# Altium project WheatstoneBridge.PrjPcb
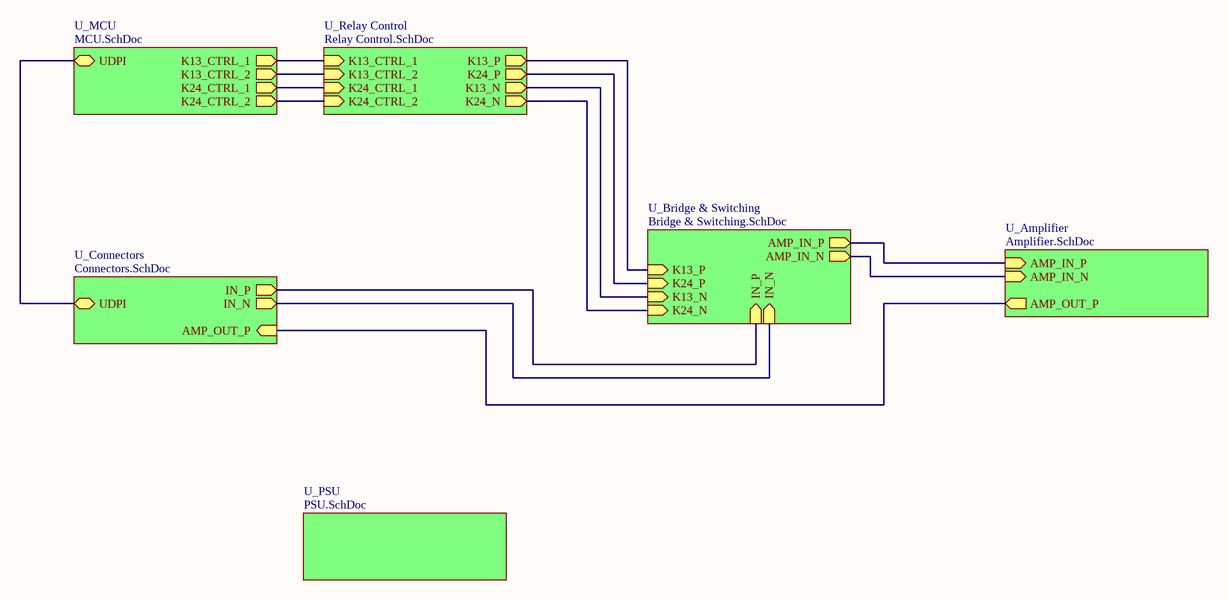
[diagram p0: TopSCH.SchDoc]
projTitle: Universal Wheatstone Bridge Amp; revision: V1.0
7 sheets, 66 parts. Net scope: hierarchical (ports join the sheet entries above them; power ports are global).
Board file: WheatstoneBridge.PcbDoc
Sheets:
  TopSCH.SchDoc
    U_Amplifier = Amplifier.SchDoc
    U_Bridge & Switching = Bridge & Switching.SchDoc
    U_PSU = PSU.SchDoc
    U_MCU = MCU.SchDoc
    U_Connectors = Connectors.SchDoc
    U_Relay Control = Relay Control.SchDoc

## Sheet TopSCH.SchDoc: FER_TEMPLATE
size A4; Author: Leon Baždar; CompanyName: FER; Address1: Zagreb; SheetNumber: 1; SheetTotal: 7

### Sub-sheets
U_Amplifier = Amplifier.SchDoc: AMP_IN_P (in), AMP_IN_N (in), AMP_OUT_P (out)
U_Bridge & Switching = Bridge & Switching.SchDoc: IN_P (in), IN_N (in), AMP_IN_P (out), AMP_IN_N (out), K13_P (in), K24_P (in), K13_N (in), K24_N (in)
U_Connectors = Connectors.SchDoc: IN_P (out), IN_N (out), AMP_OUT_P (in), UDPI (bidir)
U_MCU = MCU.SchDoc: K13_CTRL_1 (out), K13_CTRL_2 (out), K24_CTRL_1 (out), K24_CTRL_2 (out), UDPI (bidir)
U_PSU = PSU.SchDoc: no entries
U_Relay Control = Relay Control.SchDoc: K13_P (out), K24_P (out), K13_N (out), K24_N (out), K13_CTRL_1 (in), K13_CTRL_2 (in), K24_CTRL_1 (in), K24_CTRL_2 (in)

### Nets
AMP_IN_N: sheet U_Amplifier/AMP_IN_N, sheet U_Bridge & Switching/AMP_IN_N
AMP_IN_P: sheet U_Amplifier/AMP_IN_P, sheet U_Bridge & Switching/AMP_IN_P
IN_N: sheet U_Bridge & Switching/IN_N, sheet U_Connectors/IN_N
IN_P: sheet U_Bridge & Switching/IN_P, sheet U_Connectors/IN_P
K13_CTRL_1: sheet U_MCU/K13_CTRL_1, sheet U_Relay Control/K13_CTRL_1
K13_CTRL_2: sheet U_MCU/K13_CTRL_2, sheet U_Relay Control/K13_CTRL_2
K13_N: sheet U_Bridge & Switching/K13_N, sheet U_Relay Control/K13_N
K13_P: sheet U_Bridge & Switching/K13_P, sheet U_Relay Control/K13_P
K24_CTRL_1: sheet U_MCU/K24_CTRL_1, sheet U_Relay Control/K24_CTRL_1
K24_CTRL_2: sheet U_MCU/K24_CTRL_2, sheet U_Relay Control/K24_CTRL_2
K24_N: sheet U_Bridge & Switching/K24_N, sheet U_Relay Control/K24_N
K24_P: sheet U_Bridge & Switching/K24_P, sheet U_Relay Control/K24_P
OUT_P: sheet U_Amplifier/AMP_OUT_P, sheet U_Connectors/AMP_OUT_P
UDPI: sheet U_MCU/UDPI, sheet U_Connectors/UDPI

### Notes on the sheet
- Project:
- File:
- Size:
- A4
- Author:
- Revision:
- Date:
- Sheet
- of

## Sheet Amplifier.SchDoc: FER_TEMPLATE
size A4; Author: Leon Baždar; CompanyName: FER; Address1: Zagreb; SheetNumber: 2; SheetTotal: 7
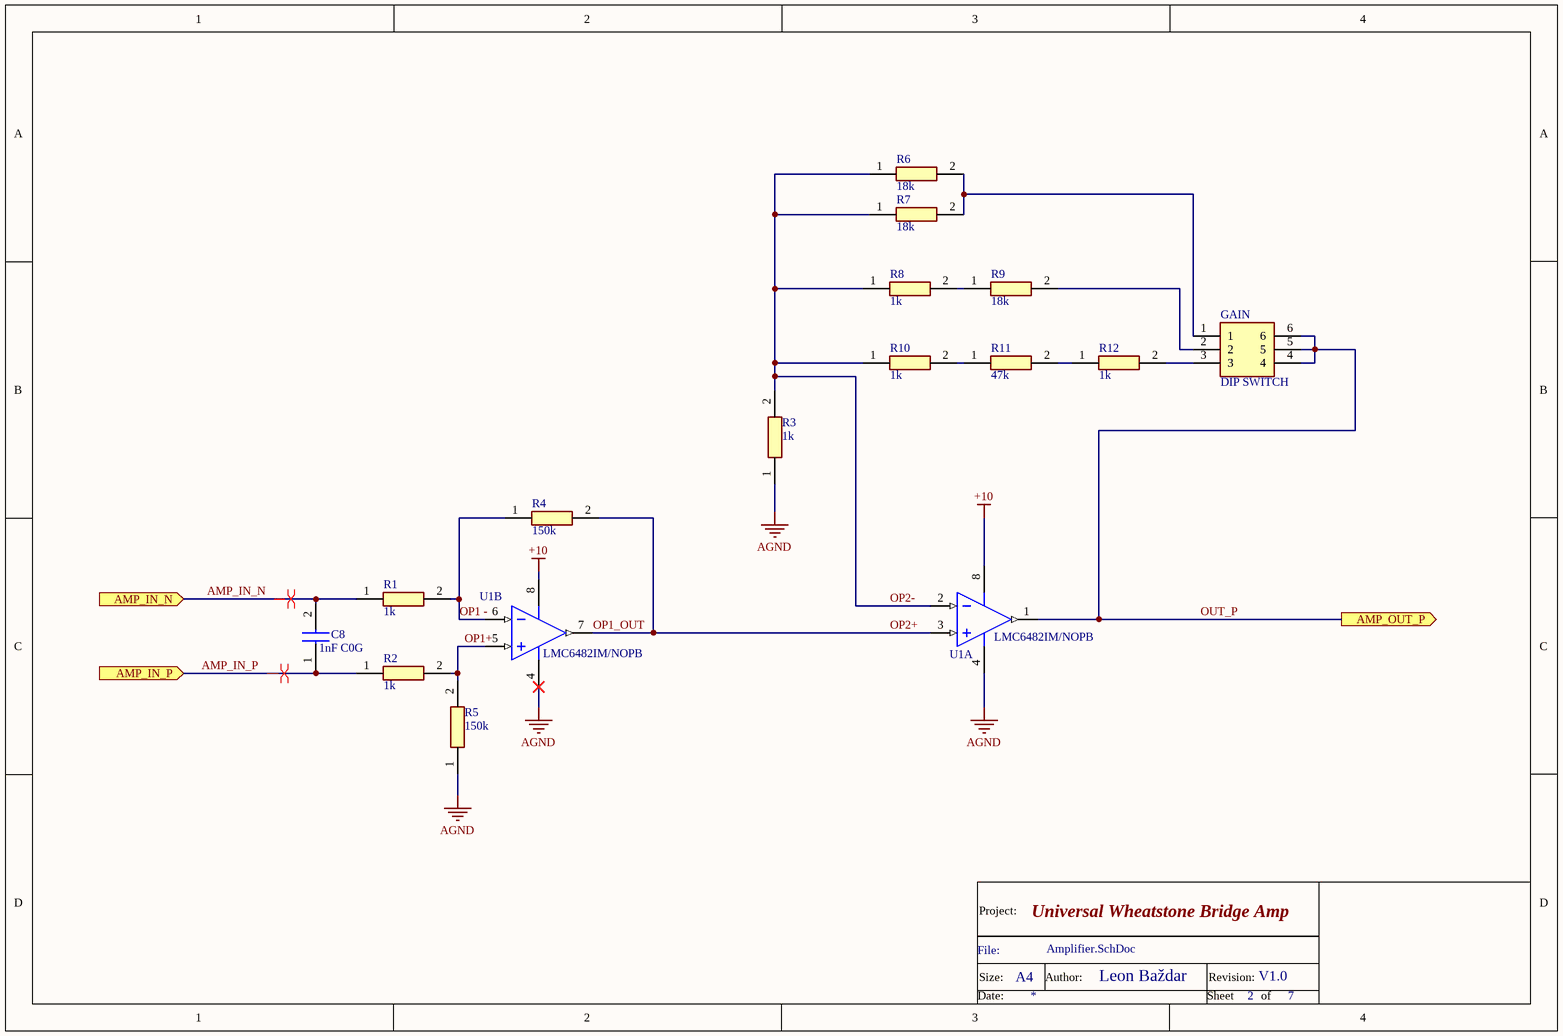
[diagram p1: Amplifier.SchDoc]

### Parts
C8  1nF C0G  [CAPC1005X55N]
GAIN  DIP SWITCH  [2193LPSTR]
R1  1k  [ERA2V_(0402)]
R2  1k  [ERA2V_(0402)]
R3  1k  [ERA2V_(0402)]
R4  150k  [RESC1005X35N]
R5  150k  [RESC1005X35N]
R6  18k  [RESC1005X35N]
R7  18k  [RESC1005X35N]
R8  1k  [ERA2V_(0402)]
R9  18k  [RESC1005X35N]
R10  1k  [ERA2V_(0402)]
R11  47k  [ERA2A_(0402)]
R12  1k  [ERA2V_(0402)]
U1  LMC6482IM/NOPB  [D0008A_N]  (parts A,B of 2)

### Ports
AMP_IN_N (in), AMP_IN_P (in), AMP_OUT_P (out)

### Nets
+10: U1.8(V+)  [project net WH_VCC]
AGND: R3.1 R5.1 U1.4(V-)
AMP_IN_N: C8.2 R1.1 ; port AMP_IN_N
AMP_IN_P: C8.1 R2.1 ; port AMP_IN_P
OP1 -: R1.2 R4.1 U1.6(INB-)
OP1+: R2.2 R5.2 U1.5(INB+)
OP1_OUT: R4.2 U1.3(INA+) U1.7(OUTB)  [also labelled OP2+]
OP2-: R3.2 R6.1 R7.1 R8.1 R10.1 U1.2(INA-)
OUT_P: GAIN.4 GAIN.5 GAIN.6 U1.1(OUTA) ; port AMP_OUT_P
NetGAIN_1: GAIN.1 R6.2 R7.2
NetGAIN_2: GAIN.2 R9.2
NetGAIN_3: GAIN.3 R12.2
NetR8_2: R8.2 R9.1
NetR10_2: R10.2 R11.1
NetR11_2: R11.2 R12.1

### Layout directives
differential pair: AMP_IN_N, AMP_IN_P

### Notes on the sheet
- Project:
- File:
- Size:
- A4
- Author:
- Revision:
- Date:
- Sheet
- of

### Library data of the parts
C8 = CGA2B2C0G1H102J050BE: Capacitor; Manufacturer_Name: TDK; Datasheet Link: https://product.tdk.com/system/files/dam/doc/product/capacitor/ceramic/mlcc/catalog/mlcc_automotive_soft_en.pdf; Height: 0.55mm; Manufacturer_Part_Number: CGA2B2C0G1H102J050BE
GAIN = 219-3LPSTR: Switch; Manufacturer_Name: CTS; Datasheet Link: https://www.ctscorp.com/wp-content/uploads/219.pdf; Height: 3.95mm; Manufacturer_Part_Number: 219-3LPSTR
R1-R3 R8 R10 R12 = ERA-2VEB1001X: Resistor; Manufacturer_Name: Panasonic; Datasheet Link: http://industrial.panasonic.com/cdbs/www-data/pdf/RDM0000/RDM0000C331.pdf; Height: 0.4mm; Manufacturer_Part_Number: ERA-2VEB1001X
R4 R5 = CPF0402B150KE1: Resistor; Manufacturer_Name: TE Connectivity; Height: 0.35mm; Manufacturer_Part_Number: CPF0402B150KE1
R6 R7 R9 = CPF0402B18KE1: Resistor; Manufacturer_Name: TE Connectivity; Height: 0.35mm; Manufacturer_Part_Number: CPF0402B18KE1
R11 = ERA-2APB473X: Resistor; Manufacturer_Name: Panasonic; Datasheet Link: http://industrial.panasonic.com/cdbs/www-data/pdf/RDM0000/AOA0000C307.pdf; Height: 0.4mm; Manufacturer_Part_Number: ERA-2APB473X
U1 = CMP-0055-00847-3: CMOS Dual Rail-to-Rail Input and Output Operational Amplifier, 8-pin Narrow SOIC, Pb-Free; Manufacturer: Texas Instruments; PackageTopMarking: NSZXTT*LMC64*82IM; CompType: Amplifiers; PowerWise: N; ComponentLink1URL: http://www.ti.com/general/docs/lit/getliterature.tsp?genericPartNumber=LMC6482&fileType=pdf; Code_IPC: SOIC127P600-8; RoHS: Y; PinCount: 8; PackageDescription: SOIC Narrow, 4.9 x 3.9 x 1.45mm, 8 Lead, 1.27mm Pitch; Package Reference: D0008A; ComponentLink1Description: Datasheet URL; Code_JEDEC: MS-012-AA

## Sheet Bridge & Switching.SchDoc: FER_TEMPLATE
size A4; Author: Leon Baždar; CompanyName: FER; Address1: Zagreb; SheetNumber: 5; SheetTotal: 7
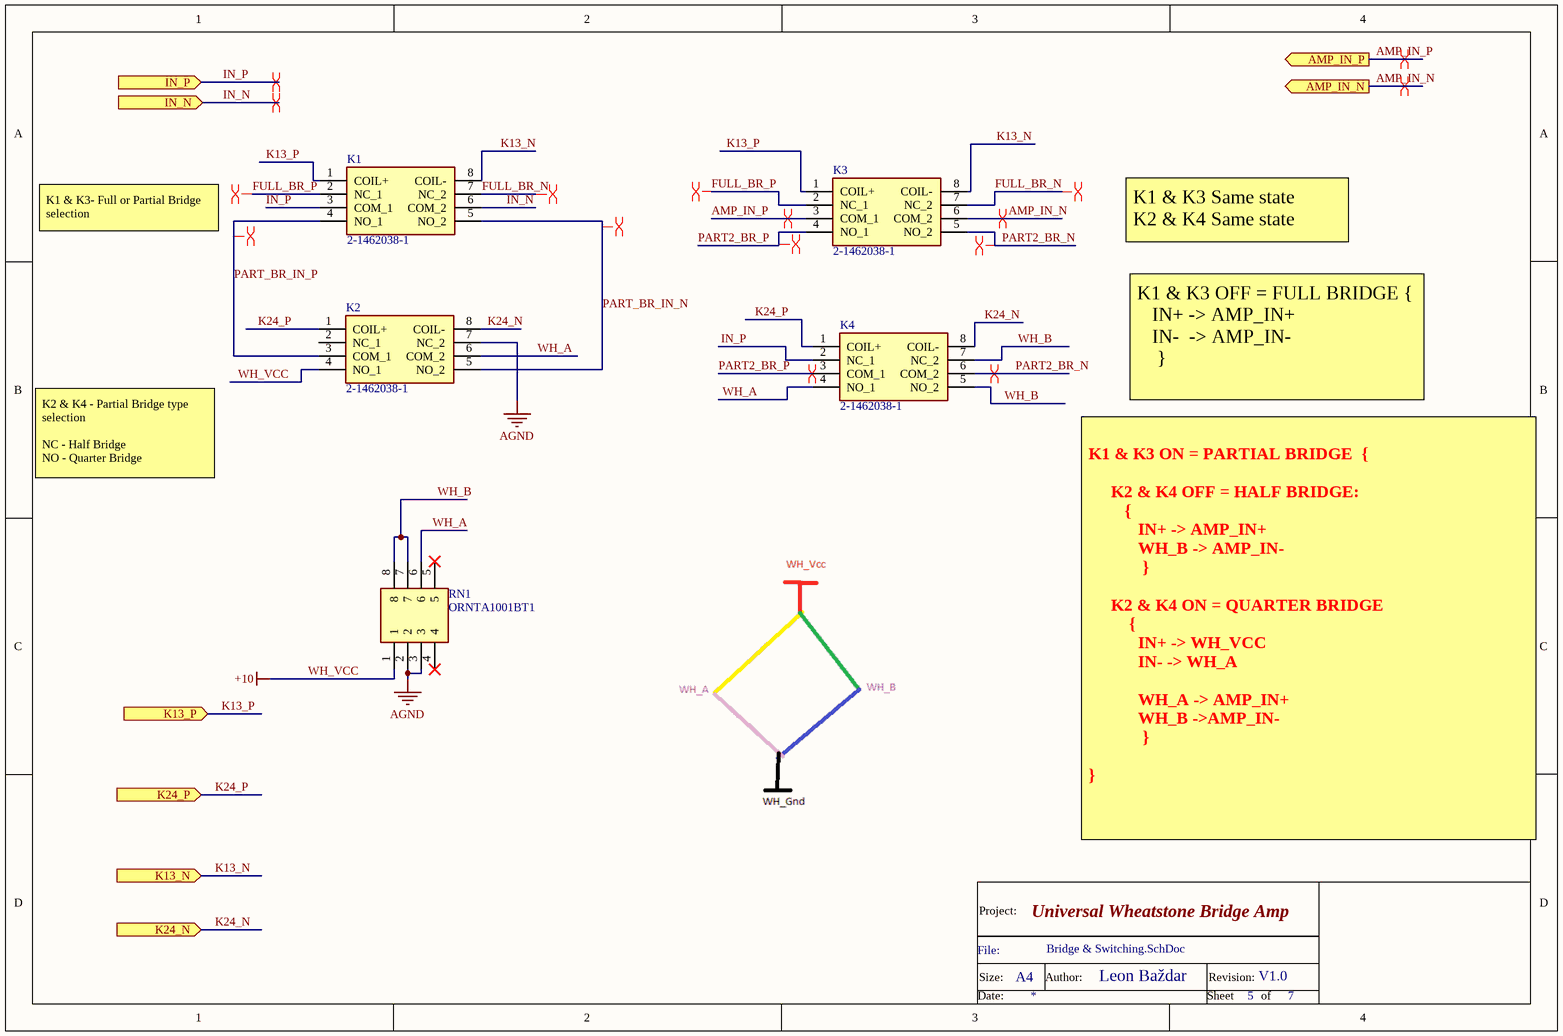
[diagram p2: Bridge & Switching.SchDoc]

### Parts
K1  2-1462038-1  [214620381]
K2  2-1462038-1  [214620381]
K3  2-1462038-1  [214620381]
K4  2-1462038-1  [214620381]
RN1  ORNTA1001BT1  [SOIC127P607X173-8N]

### Ports
AMP_IN_N (out), AMP_IN_P (out), IN_N (in), IN_P (in), K13_N (in), K13_P (in), K24_N (in), K24_P (in)

### Nets
AGND: K2.7(NC_2) RN1.2 RN1.3
WH_VCC: K2.4(NO_1) RN1.1  [also labelled +10]
AMP_IN_N: K3.6(COM_2) ; port AMP_IN_N
AMP_IN_P: K3.3(COM_1) ; port AMP_IN_P
FULL_BR_N: K1.7(NC_2) K3.7(NC_2)
FULL_BR_P: K1.2(NC_1) K3.2(NC_1)
IN_N: K1.6(COM_2) ; port IN_N
IN_P: K1.3(COM_1) K4.2(NC_1) ; port IN_P
K13_N: K1.8(COIL-) K3.8(COIL-) ; port K13_N
K13_P: K1.1(COIL+) K3.1(COIL+) ; port K13_P
K24_N: K2.8(COIL-) K4.8(COIL-) ; port K24_N
K24_P: K2.1(COIL+) K4.1(COIL+) ; port K24_P
PART2_BR_N: K3.5(NO_2) K4.6(COM_2)
PART2_BR_P: K3.4(NO_1) K4.3(COM_1)
PART_BR_IN_N: K1.5(NO_2) K2.5(NO_2)
PART_BR_IN_P: K1.4(NO_1) K2.3(COM_1)
WH_A: K2.6(COM_2) K4.4(NO_1) RN1.6
WH_B: K4.5(NO_2) K4.7(NC_2) RN1.7 RN1.8

Not connected (* = marked no-connect by the designer): K2 2(NC_1); RN1 4* 5*

### Layout directives
differential pair: AMP_IN_N, AMP_IN_P, FULL_BR_N, FULL_BR_P, IN_N, IN_P, PART2_BR_N, PART2_BR_P, PART_BR_IN_N, PART_BR_IN_P

### Notes on the sheet
- K1 & K3- Full or Partial Bridge selection
- K1 & K3 Same state
  K2 & K4 Same state
- K1 & K3 OFF = FULL BRIDGE {
  IN+ -> AMP_IN+
  IN-  -> AMP_IN-
  }
- K2 & K4 - Partial Bridge type selection
  NC - Half Bridge
  NO - Quarter Bridge
- K1 & K3 ON = PARTIAL BRIDGE  {
  K2 & K4 OFF = HALF BRIDGE:
  {
  IN+ -> AMP_IN+
  WH_B -> AMP_IN-
  }
  K2 & K4 ON = QUARTER BRIDGE
  {
  IN+ -> WH_VCC
  IN- -> WH_A
  WH_A -> AMP_IN+
  WH_B ->AMP_IN-
  }
  }
- Project:
- File:
- Size:
- A4
- Author:
- Revision:
- Date:
- Sheet
- of

### Library data of the parts
K1-K4 = 2-1462038-1: Relay or Contactor; Manufacturer_Name: TE Connectivity; Datasheet Link: https://www.te.com/commerce/DocumentDelivery/DDEController?Action=srchrtrv&DocNm=108-98001&DocType=Data+Sheet&DocLang=English&PartCntxt=2-1462038-1&DocFormat=pdf; Height: 5.8mm; Manufacturer_Part_Number: 2-1462038-1
RN1 = ORNTA1001BT1: Resistor Network; Manufacturer_Name: Vishay; Datasheet Link: https://www.vishay.com/docs/60005/orn.pdf; Height: 1.73mm; Manufacturer_Part_Number: ORNTA1001BT1; Mouser Part Number: 71-ORNTA1001BT1; Mouser Price/Stock: https://www.mouser.co.uk/ProductDetail/Vishay-Thin-Film/ORNTA1001BT1?qs=EiQZnNXpF8A9ZYJTqcYggA%3D%3D

## Sheet PSU.SchDoc
size A4; SheetNumber: 3; SheetTotal: 7
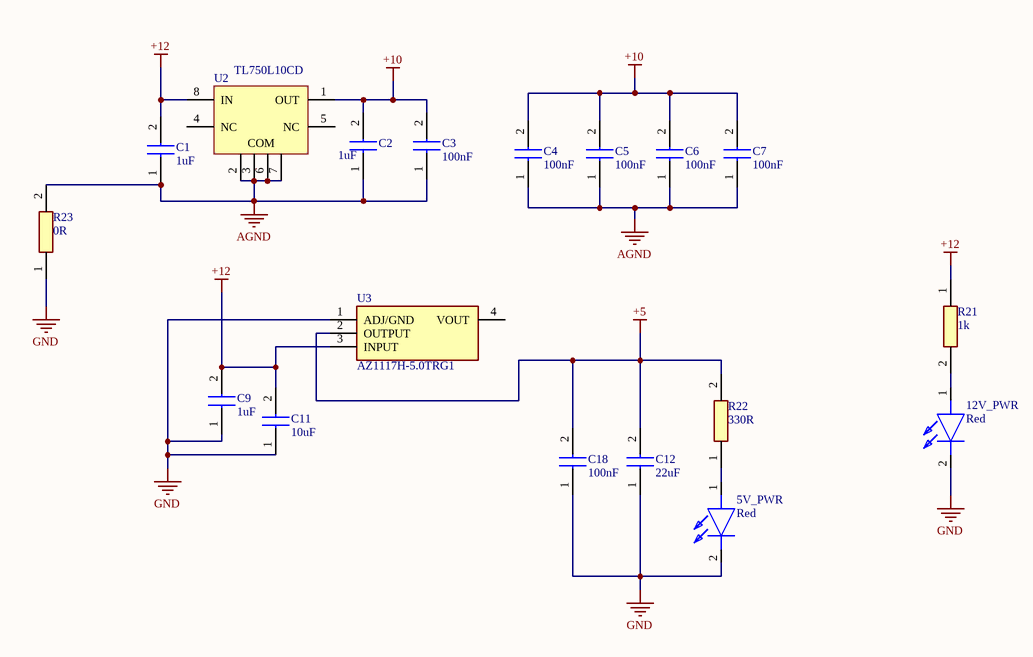
[diagram p3: PSU.SchDoc]

### Parts
5V_PWR  Red  [APT2012SECKJ3PRV]
12V_PWR  Red  [APT2012SECKJ3PRV]
C1  1uF  [CAPC1005X55N]
C2  1uF  [CAPC1005X55N]
C3  100nF  [CAPC1005X55N]
C4  100nF  [CAPC1005X55N]
C5  100nF  [CAPC1005X55N]
C6  100nF  [CAPC1005X55N]
C7  100nF  [CAPC1005X55N]
C9  1uF  [CAPC1005X55N]
C11  10uF  [C1608_Commercial]
C12  22uF  [C3216_Commercial]
C18  100nF  [CAPC1005X55N]
R21  1k  [ERA2V_(0402)]
R22  330R  [ERJ2RKD1004X]
R23  0R  [RESC1005X40N]
U2  TL750L10CD  [D0008A_M]
U3  AZ1117H-5.0TRG1  [SOT230P700X180-4N]

### Nets
+5: C12.2 C18.2 R22.2 U3.2(OUTPUT)
+10: C2.2 C3.2 C4.2 C5.2 C6.2 C7.2 U2.1(OUT)  [project net WH_VCC]
+12: C1.2 C9.2 C11.2 R21.1 U2.8(IN) U3.3(INPUT)
AGND: C1.1 C2.1 C3.1 C4.1 C5.1 C6.1 C7.1 R23.2 U2.2(COM) U2.3(COM) U2.6(COM) U2.7(COM)
GND: 5V_PWR.2(K) 12V_PWR.2(K) C9.1 C11.1 C12.1 C18.1 R23.1 U3.1(ADJ/GND)
Net5V_PWR_1: 5V_PWR.1(A) R22.1
Net12V_PWR_1: 12V_PWR.1(A) R21.2

Not connected (* = marked no-connect by the designer): U2 4(NC) 5(NC); U3 4(VOUT)

### Notes on the sheet
- Project:
- File:
- Size:
- A4
- Author:
- Revision:
- Date:
- Sheet
- of

### Library data of the parts
5V_PWR 12V_PWR = APT2012SECK_J3-PRV: LED; Manufacturer_Name: Kingbright; Manufacturer_Part_Number: APT2012SECK/J3-PRV; Datasheet Link: https://www.mouser.de/datasheet/2/216/APT2012SECK-J3-PRV-1173389.pdf; Height: 0.85mm
C1 C2 C9 = GRT155C81E105KE13D: Capacitor; Manufacturer_Name: Murata Electronics; Datasheet Link: https://psearch.en.murata.com/capacitor/product/GRT155C81E105KE13%23.html; Height: 0.55mm; Manufacturer_Part_Number: GRT155C81E105KE13D
C3-C7 C18 = GCM155L81E104KE02D: Capacitor; Manufacturer_Name: Murata Electronics; Datasheet Link: https://psearch.en.murata.com/capacitor/product/GCM155L81E104KE02%23.html; Height: 0.55mm; Manufacturer_Part_Number: GCM155L81E104KE02D
C11 = C1608JB1E106M080AC: Capacitor; Manufacturer_Name: TDK; Datasheet Link: https://product.tdk.com/system/files/dam/doc/product/capacitor/ceramic/mlcc/catalog/mlcc_commercial_general_en.pdf; Height: 0.9mm; Manufacturer_Part_Number: C1608JB1E106M080AC
C12 = C3216X6S1E226M160AC: Capacitor; Manufacturer_Name: TDK; Datasheet Link: https://product.tdk.com/system/files/dam/doc/product/capacitor/ceramic/mlcc/catalog/mlcc_commercial_general_en.pdf; Height: 0.75mm; Manufacturer_Part_Number: C3216X6S1E226M160AC
R21 = ERA-2VEB1001X: Resistor; Manufacturer_Name: Panasonic; Datasheet Link: http://industrial.panasonic.com/cdbs/www-data/pdf/RDM0000/RDM0000C331.pdf; Height: 0.4mm; Manufacturer_Part_Number: ERA-2VEB1001X
R22 = ERJ-2RHD3300X: Resistor; Manufacturer_Name: Panasonic; Datasheet Link: https://datasheet.datasheetarchive.com/originals/distributors/DKDS41/DSANUWW0038499.pdf; Height: 0.4mm; Manufacturer_Part_Number: ERJ-2RHD3300X
R23 = RC0402JR-130RL: Resistor; Manufacturer_Name: YAGEO (PHYCOMP); Datasheet Link: https://datasheet.datasheetarchive.com/originals/distributors/Datasheets_SAMA/902f9e387b938f871d31120f5fc1d65e.pdf; Height: 0.4mm; Manufacturer_Part_Number: RC0402JR-130RL
U2 = CMP-0394-00106-2: Single Output LDO, 150 mA, Fixed 10 V Output, 11 to 26 V Input, with Low IQ, 8-pin SOIC (D), 0 to 125 degC, Green (RoHS & no Sb/Br); Manufacturer: Texas Instruments; Fixed Output Options(V): 10; Accuracy(%): 4; Vdo(Typ)(mV): 600; Rating: Catalog; Iq(Typ)(mA): 1; SubFamily: Single Channel LDO; Iout(Max)(A): 0.15; Vin(Min)(V): 11; Vin(Max)(V): 26; ComponentLink1URL: http://www.ti.com/; ComponentLink3URL: http://www.ti.com/litv/pdf/msoi002j; ComponentLink4Description: URL Link1; Eco-Plan: Green (RoHS & no Sb/Br); PackageVersion: 4040047-3/M; Vout Adj(Min)(V): 10; Mounting Technology: Surface Mount; ComponentLink1Description: Manufacturer URL; PartNumber: TL750L10CD; PackageDescription: 8-Pin Plastic Small Outline, Body 4.9 x 3.9 mm, Pitch 1.27 mm; Code_JEDEC: MS-012; ComponentLink2URL: http://www.ti.com/general/docs/lit/getliterature.tsp?genericPartNumber=TL750L10&fileType=pdf; Vout Adj(Max)(V): 10; ComponentLink2Description: Datasheet; ComponentLink3Description: Package Specification; ComponentLink4URL: Samples URL:http://www.ti.com/product/tl750l10#samples; DatasheetVersion: SLVS017U; PackageReference: D0008A
U3 = AZ1117H-5.0TRG1: Integrated Circuit; Manufacturer_Name: Diodes Inc.; Datasheet Link: https://media.digikey.com/pdf/Data%20Sheets/Diodes%20PDFs/AZ1117_Rev2.1.pdf; Height: 1.8mm; Manufacturer_Part_Number: AZ1117H-5.0TRG1

## Sheet MCU.SchDoc: FER_TEMPLATE
size A4; Author: Leon Baždar; CompanyName: FER; Address1: Zagreb; SheetNumber: 7; SheetTotal: 7
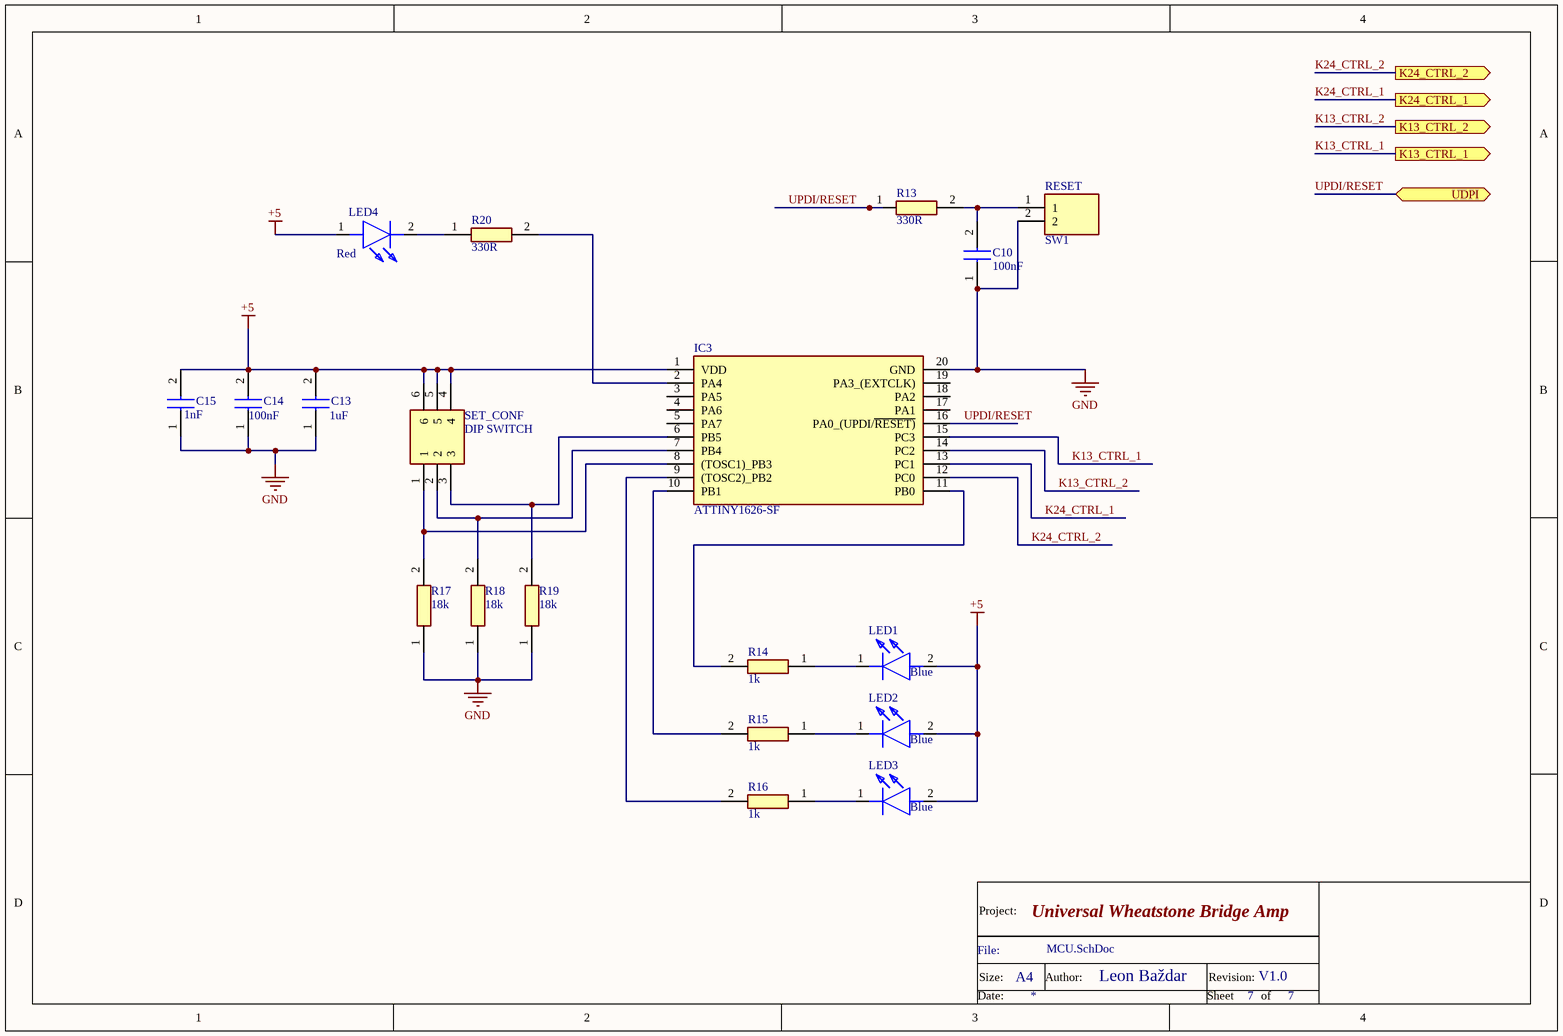
[diagram p4: MCU.SchDoc]

### Parts
C10  100nF  [CAPC1005X55N]
C13  1uF  [CAPC1005X55N]
C14  100nF  [CAPC1005X55N]
C15  1nF  [CAPC1005X55N]
IC3  ATTINY1626-SF  [SOIC127P1030X265-20N]
LED1  Blue  [LEDC2012X85N]
LED2  Blue  [LEDC2012X85N]
LED3  Blue  [LEDC2012X85N]
LED4  Red  [APT2012SECKJ3PRV]
R13  330R  [ERJ2RKD1004X]
R14  1k  [ERA2V_(0402)]
R15  1k  [ERA2V_(0402)]
R16  1k  [ERA2V_(0402)]
R17  18k  [RESC1005X35N]
R18  18k  [RESC1005X35N]
R19  18k  [RESC1005X35N]
R20  330R  [ERJ2RKD1004X]
RESET  SW1  [95C04A3GWRT]
SET_CONF  DIP SWITCH  [2193LPSTR]

### Ports
K13_CTRL_1 (out), K13_CTRL_2 (out), K24_CTRL_1 (out), K24_CTRL_2 (out), UDPI (bidir)

### Nets
+5: C13.2 C14.2 C15.2 IC3.1(VDD) LED1.2(A) LED2.2(A) LED3.2(A) LED4.1(A) SET_CONF.4 SET_CONF.5 SET_CONF.6
GND: C10.1 C13.1 C14.1 C15.1 IC3.20(GND) R17.1 R18.1 R19.1 RESET.2
K13_CTRL_1: IC3.15(PC3) ; port K13_CTRL_1
K13_CTRL_2: IC3.14(PC2) ; port K13_CTRL_2
K24_CTRL_1: IC3.13(PC1) ; port K24_CTRL_1
K24_CTRL_2: IC3.12(PC0) ; port K24_CTRL_2
UPDI/RESET: IC3.16(PA0_(UPDI/~{RESET)}) R13.1 ; port UDPI  [project net UDPI]
NetC10_2: C10.2 R13.2 RESET.1
NetIC3_2: IC3.2(PA4) R20.2
NetIC3_6: IC3.6(PB5) R19.2 SET_CONF.3
NetIC3_7: IC3.7(PB4) R18.2 SET_CONF.2
NetIC3_8: IC3.8((TOSC1)_PB3) R17.2 SET_CONF.1
NetIC3_9: IC3.9((TOSC2)_PB2) R16.2
NetIC3_10: IC3.10(PB1) R15.2
NetIC3_11: IC3.11(PB0) R14.2
NetLED1_1: LED1.1(K) R14.1
NetLED2_1: LED2.1(K) R15.1
NetLED3_1: LED3.1(K) R16.1
NetLED4_2: LED4.2(K) R20.1

Not connected (* = marked no-connect by the designer): IC3 3(PA5) 4(PA6) 5(PA7) 17(PA1) 18(PA2) 19(PA3_(EXTCLK))

### Notes on the sheet
- Project:
- File:
- Size:
- A4
- Author:
- Revision:
- Date:
- Sheet
- of

### Library data of the parts
C10 C14 = GCM155L81E104KE02D: as C3 on sheet PSU; Datasheet Link: https://psearch.en.murata.com/capacitor/product/GCM155L81E104KE02%23.html; Height: 0.55mm; Manufacturer_Part_Number: GCM155L81E104KE02D
C13 = GRT155C81E105KE13D: as C1 on sheet PSU; Datasheet Link: https://psearch.en.murata.com/capacitor/product/GRT155C81E105KE13%23.html; Height: 0.55mm; Manufacturer_Part_Number: GRT155C81E105KE13D
C15 = CGA2B2C0G1H102J050BE: Capacitor; Manufacturer_Name: TDK; Datasheet Link: https://product.tdk.com/system/files/dam/doc/product/capacitor/ceramic/mlcc/catalog/mlcc_automotive_soft_en.pdf; Height: 0.55mm; Manufacturer_Part_Number: CGA2B2C0G1H102J050BE
IC3 = ATTINY1626-SF: Integrated Circuit; Manufacturer_Name: Microchip; Datasheet Link: https://ww1.microchip.com/downloads/aemDocuments/documents/MCU08/ProductDocuments/DataSheets/ATtiny1624-26-27-DataSheet-DS40002234B.pdf; Height: 2.65mm; Manufacturer_Part_Number: ATTINY1626-SF
LED1-LED3 = APT2012LVBC_D: LED; Manufacturer_Name: Kingbright; Manufacturer_Part_Number: APT2012LVBC/D; Datasheet Link: https://componentsearchengine.com//APT2012LVBC_D.pdf; Height: 0.85mm; Mouser2 Part Number: 604-APT2012LVBCD; Mouser2 Price/Stock: https://www.mouser.com/Search/Refine.aspx?Keyword=604-APT2012LVBCD
LED4 = APT2012SECK_J3-PRV: as 5V_PWR on sheet PSU; Datasheet Link: https://www.mouser.de/datasheet/2/216/APT2012SECK-J3-PRV-1173389.pdf; Height: 0.85mm
R13 R20 = ERJ-2RHD3300X: Resistor; Manufacturer_Name: Panasonic; Datasheet Link: https://datasheet.datasheetarchive.com/originals/distributors/DKDS41/DSANUWW0038499.pdf; Height: 0.4mm; Manufacturer_Part_Number: ERJ-2RHD3300X
R14-R16 = ERA-2VEB1001X: Resistor; Manufacturer_Name: Panasonic; Datasheet Link: http://industrial.panasonic.com/cdbs/www-data/pdf/RDM0000/RDM0000C331.pdf; Height: 0.4mm; Manufacturer_Part_Number: ERA-2VEB1001X
R17-R19 = CPF0402B18KE1: as R6 on sheet Amplifier; Height: 0.35mm; Manufacturer_Part_Number: CPF0402B18KE1
RESET = 95C04A3GWRT: Switch; Manufacturer_Name: Grayhill; Datasheet Link: https://componentsearchengine.com//95C04A3GWRT.pdf; Mouser2 Part Number: 706-95C04A3GWRT; Mouser2 Price/Stock: https://www.mouser.com/Search/Refine.aspx?Keyword=706-95C04A3GWRT; Manufacturer_Part_Number: 95C04A3GWRT
SET_CONF = 219-3LPSTR: Switch; Manufacturer_Name: CTS; Datasheet Link: https://www.ctscorp.com/wp-content/uploads/219.pdf; Height: 3.95mm; Manufacturer_Part_Number: 219-3LPSTR

## Sheet Connectors.SchDoc: FER_TEMPLATE
size A4; Author: Leon Baždar; CompanyName: FER; Address1: Zagreb; SheetNumber: 4; SheetTotal: 7
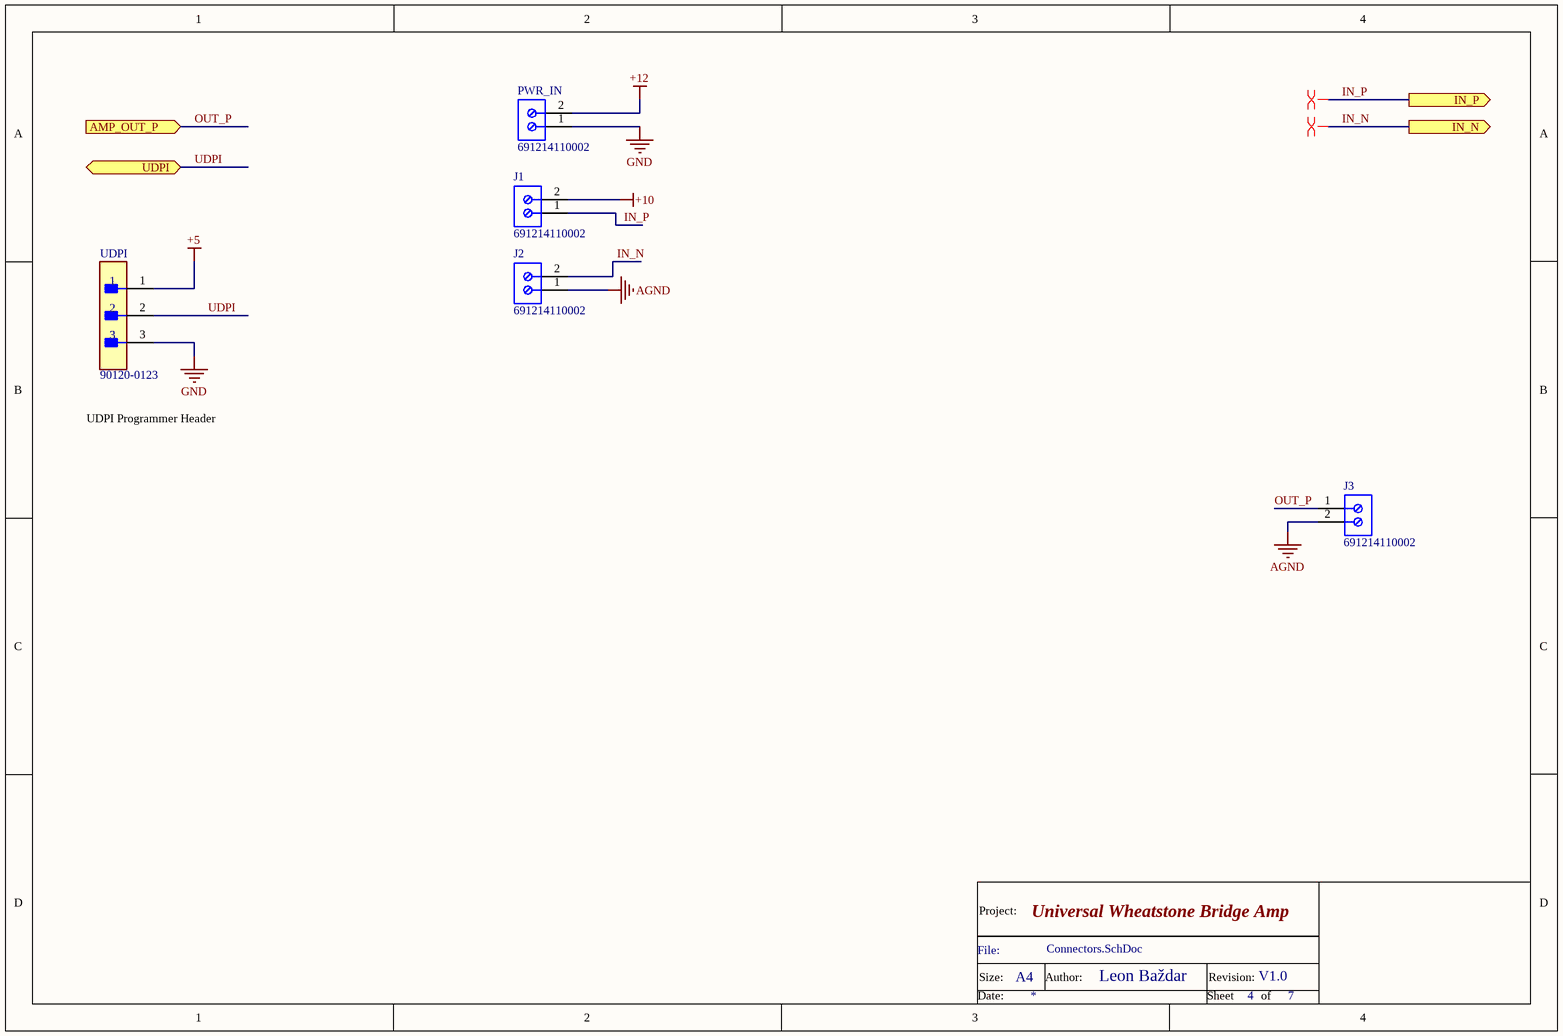
[diagram p5: Connectors.SchDoc]

### Parts
J1  691214110002  [691214110002]
J2  691214110002  [691214110002]
J3  691214110002  [691214110002]
PWR_IN  691214110002  [691214110002]
UDPI  90120-0123  [FP-90120-0123-MFG]

### Ports
AMP_OUT_P (in), IN_N (out), IN_P (out), UDPI (bidir)

### Nets
+5: UDPI.1
+10: J1.2  [project net WH_VCC]
+12: PWR_IN.2
AGND: J2.1 J3.2
GND: PWR_IN.1 UDPI.3
IN_N: J2.2 ; port IN_N
IN_P: J1.1 ; port IN_P
OUT_P: J3.1 ; port AMP_OUT_P
UDPI: UDPI.2 ; port UDPI

### Layout directives
differential pair: IN_N, IN_P

### Notes on the sheet
- UDPI Programmer Header
- Project:
- File:
- Size:
- A4
- Author:
- Revision:
- Date:
- Sheet
- of

### Library data of the parts
J1-J3 PWR_IN = CMP-1502-02464-1: Serie 2141 - 3.50 mm Horizontal Entry Modular with Rising Cage Clamp WR-TBL, 2 pin; Manufacturer: Wurth Elektronik; Pin Number: 2; Pitch: 3.50mm; Datasheet URL: http://katalog.we-online.de/em/datasheet/6912141100xx.pdf; Packaging: Box; Mounting Technology: THT; Package Reference: 691214110002; Manufacturer URL: http://www.we-online.de; Part Number: 691214110002; Publisher: WurthElektronik; Operating Temperature: -40to105degC
UDPI = CMP-04776-000237-1: CONN HEADER VERT 3POS 2.54MM; Number of Circuits: 3; Max Voltage Rating (DC): 350.35kV; Contact Resistance: 20mR; Gender: Male; Voltage Rating (AC): 350V; Glow Wire Compliant: Non-compliant; Current Rating: 3A; Contact Post Length: 2.9mm; Number of Contacts: 3; Number of Rows: 1; Max Operating Temperature: 125°C; Orientation: Vertical; Number of Positions: 3; Packaging: Tray; Contact Mating Length: 6.75mm; Housing Color: Black; Termination: Solder; Contact Material: Brass; Radiation Hardening: No; Lead Free: Lead Free; Pitch: 2.54mm; RoHS Compliant: Yes; Voltage Rating: 350V; Contact Plating: Tin; Color: Black; Min Operating Temperature: -55°C; Mount: Through Hole; Housing Material: Polyester; Series: 90120; Contact Gender: Male; REACH SVHC: No SVHC

## Sheet Relay Control.SchDoc: FER_TEMPLATE
size A4; Author: Leon Baždar; CompanyName: FER; Address1: Zagreb; SheetNumber: 6; SheetTotal: 7
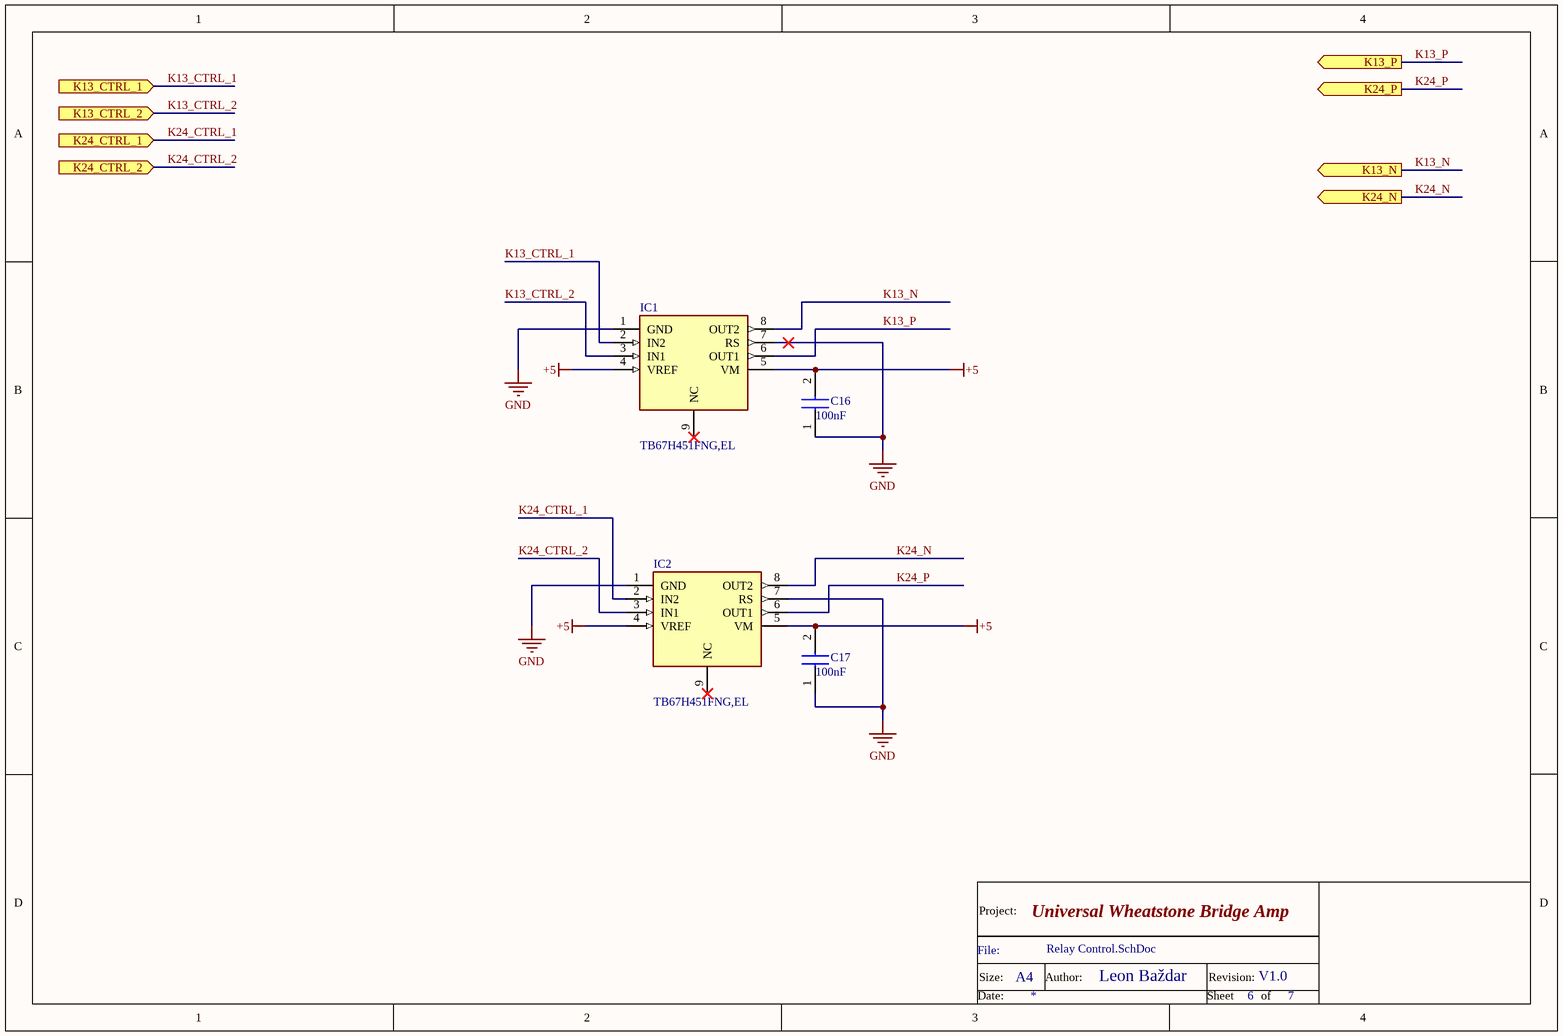
[diagram p6: Relay Control.SchDoc]

### Parts
C16  100nF  [CAPC1005X55N]
C17  100nF  [CAPC1005X55N]
IC1  TB67H451FNG,EL  [SOIC127P600X170-9N]
IC2  TB67H451FNG,EL  [SOIC127P600X170-9N]

### Ports
K13_CTRL_1 (in), K13_CTRL_2 (in), K13_N (out), K13_P (out), K24_CTRL_1 (in), K24_CTRL_2 (in), K24_N (out), K24_P (out)

### Nets
+5: C16.2 C17.2 IC1.4(VREF) IC1.5(VM) IC2.4(VREF) IC2.5(VM)
GND: C16.1 C17.1 IC1.1(GND) IC1.7(RS) IC2.1(GND) IC2.7(RS)
K13_CTRL_1: IC1.2(IN2) ; port K13_CTRL_1
K13_CTRL_2: IC1.3(IN1) ; port K13_CTRL_2
K13_N: IC1.8(OUT2) ; port K13_N
K13_P: IC1.6(OUT1) ; port K13_P
K24_CTRL_1: IC2.2(IN2) ; port K24_CTRL_1
K24_CTRL_2: IC2.3(IN1) ; port K24_CTRL_2
K24_N: IC2.8(OUT2) ; port K24_N
K24_P: IC2.6(OUT1) ; port K24_P

Not connected (* = marked no-connect by the designer): IC1 9(NC)*; IC2 9(NC)*

### Notes on the sheet
- Project:
- File:
- Size:
- A4
- Author:
- Revision:
- Date:
- Sheet
- of

### Library data of the parts
C16 C17 = GCM155L81E104KE02D: as C3 on sheet PSU; Datasheet Link: https://psearch.en.murata.com/capacitor/product/GCM155L81E104KE02%23.html; Height: 0.55mm; Manufacturer_Part_Number: GCM155L81E104KE02D
IC1 IC2 = TB67H451FNG,EL: Integrated Circuit; Manufacturer_Name: Toshiba; Datasheet Link: https://www.mouser.it/datasheet/2/408/TB67H451FNG_datasheet_en_20191111-1713881.pdf; Height: 1.7mm; Manufacturer_Part_Number: TB67H451FNG,EL

## Nets that join several sheets
+5: PSU (C12.2 C18.2 R22.2 U3.2), MCU (11 pins), Connectors (UDPI.1), Relay Control (6 pins)
+12: PSU (6 pins), Connectors (PWR_IN.2)
AGND: Amplifier (R3.1 R5.1 U1.4), Bridge & Switching (K2.7 RN1.2 RN1.3), PSU (12 pins), Connectors (J2.1 J3.2)
GND: PSU (8 pins), MCU (9 pins), Connectors (PWR_IN.1 UDPI.3), Relay Control (6 pins)
WH_VCC: Amplifier (U1.8), Bridge & Switching (K2.4 RN1.1), PSU (7 pins), Connectors (J1.2)
AMP_IN_N: Amplifier (C8.2 R1.1), Bridge & Switching (K3.6)
AMP_IN_P: Amplifier (C8.1 R2.1), Bridge & Switching (K3.3)
IN_N: Bridge & Switching (K1.6), Connectors (J2.2)
IN_P: Bridge & Switching (K1.3 K4.2), Connectors (J1.1)
K13_CTRL_1: MCU (IC3.15), Relay Control (IC1.2)
K13_CTRL_2: MCU (IC3.14), Relay Control (IC1.3)
K13_N: Bridge & Switching (K1.8 K3.8), Relay Control (IC1.8)
K13_P: Bridge & Switching (K1.1 K3.1), Relay Control (IC1.6)
K24_CTRL_1: MCU (IC3.13), Relay Control (IC2.2)
K24_CTRL_2: MCU (IC3.12), Relay Control (IC2.3)
K24_N: Bridge & Switching (K2.8 K4.8), Relay Control (IC2.8)
K24_P: Bridge & Switching (K2.1 K4.1), Relay Control (IC2.6)
OUT_P: Amplifier (GAIN.4 GAIN.5 GAIN.6 U1.1), Connectors (J3.1)
UDPI: MCU (IC3.16 R13.1), Connectors (UDPI.2)